# Altium schematic sheet ADC088S022_VAR.SchDoc
size A4; SheetNumber: 15; SheetTotal: 15
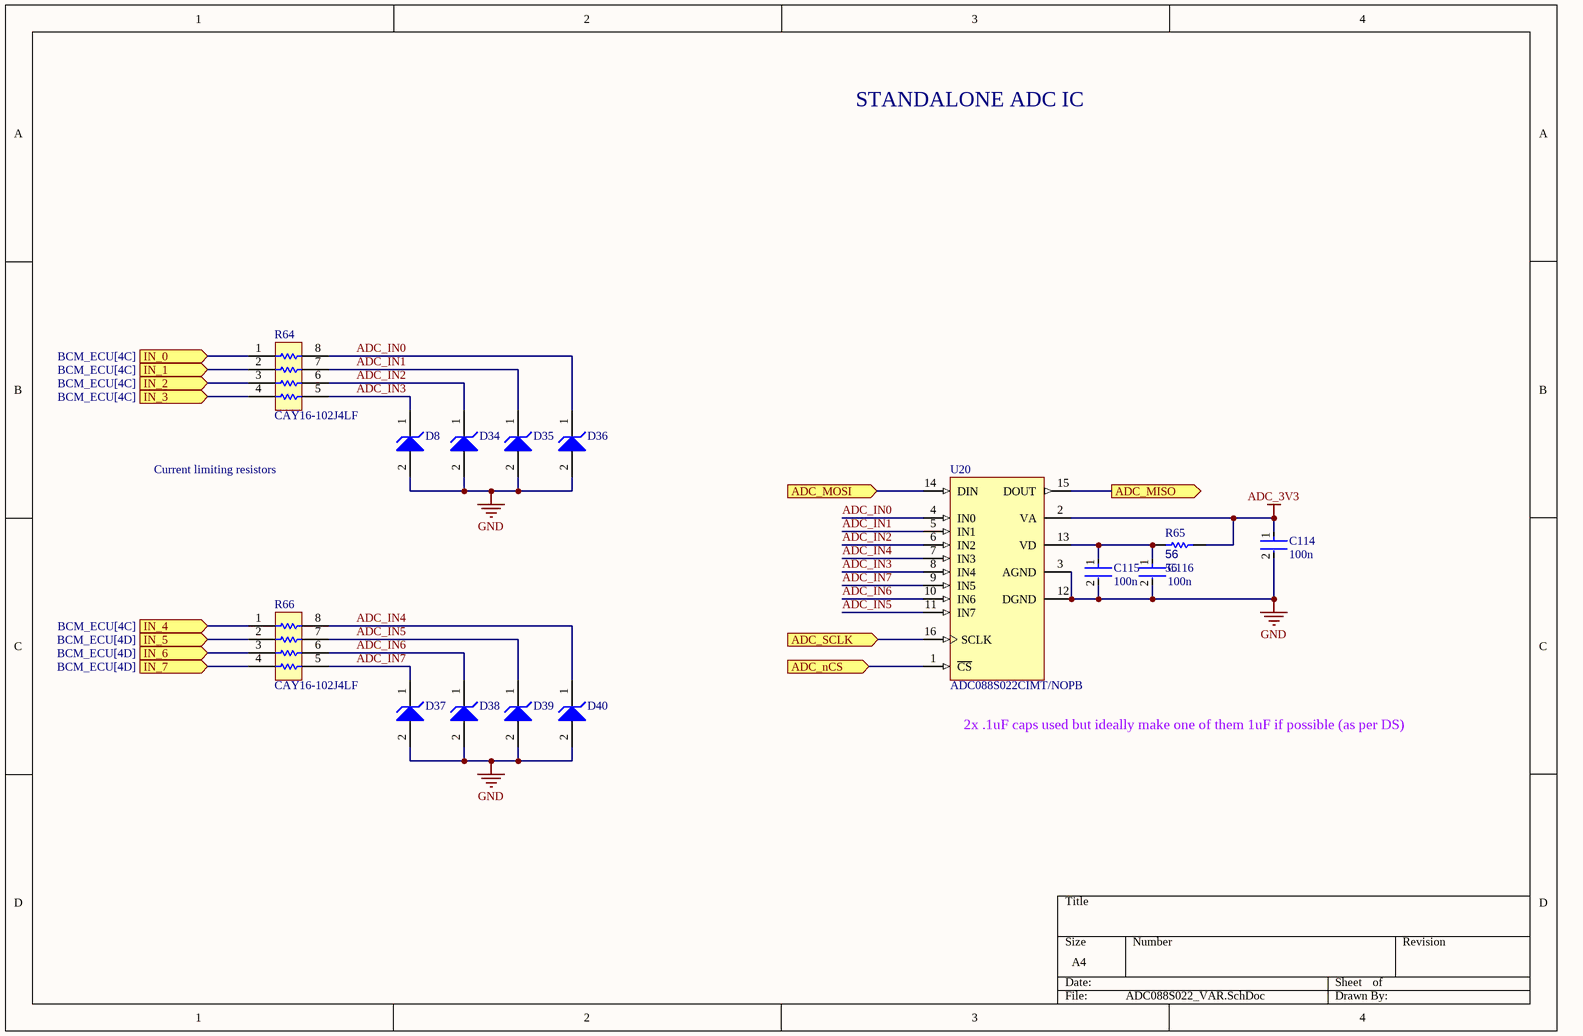
[diagram p0: ADC088S022_VAR.SchDoc]

## Parts
C114  100n  [FP-0402-L_1_0_0_05-W_0_5-IPC_A]
C115  100n  [FP-0402-L_1_0_0_05-W_0_5-IPC_A]
C116  100n  [FP-0402-L_1_0_0_05-W_0_5-IPC_A]
D8  MM5Z3V3T1G  [ONSC-SOD-523-2-502-01_V]  (value not drawn)
D34  MM5Z3V3T1G  [ONSC-SOD-523-2-502-01_V]  (value not drawn)
D35  MM5Z3V3T1G  [ONSC-SOD-523-2-502-01_V]  (value not drawn)
D36  MM5Z3V3T1G  [ONSC-SOD-523-2-502-01_V]  (value not drawn)
D37  MM5Z3V3T1G  [ONSC-SOD-523-2-502-01_V]  (value not drawn)
D38  MM5Z3V3T1G  [ONSC-SOD-523-2-502-01_V]  (value not drawn)
D39  MM5Z3V3T1G  [ONSC-SOD-523-2-502-01_V]  (value not drawn)
D40  MM5Z3V3T1G  [ONSC-SOD-523-2-502-01_V]  (value not drawn)
R64  CAY16-102J4LF  [BOUR-CAY16-J4_V]
R65  56  [R0603B]
R66  CAY16-102J4LF  [BOUR-CAY16-J4_V]
U20  ADC088S022CIMT/NOPB  [MTC16_L]

## Ports
ADC_MISO (out, see BCM_ECU[4C], ADC088S022[3B], MOSFET_BANK[1C]), ADC_MOSI (in, see BCM_ECU[4C], ADC088S022[3B], MOSFET_BANK[1C]), ADC_nCS (in, see BCM_ECU[4C]), ADC_SCLK (in, see BCM_ECU[4C], ADC088S022[3C], MOSFET_BANK[1D]), IN_0 (in, see BCM_ECU[4C]), IN_1 (in, see BCM_ECU[4C]), IN_2 (in, see BCM_ECU[4C]), IN_3 (in, see BCM_ECU[4C]), IN_4 (in, see BCM_ECU[4C]), IN_5 (in, see BCM_ECU[4D]), IN_6 (in, see BCM_ECU[4D]), IN_7 (in, see BCM_ECU[4D])

## Nets
ADC_3V3: C114.1 R65.1 U20.2(VA)
GND: C114.2 C115.2 C116.2 D8.2(A) D34.2(A) D35.2(A) D36.2(A) D37.2(A) D38.2(A) D39.2(A) D40.2(A) U20.3(AGND) U20.12(DGND)
ADC_IN0: D36.1(K) R64.8 U20.4(IN0)
ADC_IN1: D35.1(K) R64.7 U20.5(IN1)
ADC_IN2: D34.1(K) R64.6 U20.6(IN2)
ADC_IN3: D8.1(K) R64.5 U20.8(IN4)
ADC_IN4: D40.1(K) R66.8 U20.7(IN3)
ADC_IN5: D39.1(K) R66.7 U20.11(IN7)
ADC_IN6: D38.1(K) R66.6 U20.10(IN6)
ADC_IN7: D37.1(K) R66.5 U20.9(IN5)
ADC_MISO: U20.15(DOUT) ; port ADC_MISO
ADC_MOSI: U20.14(DIN) ; port ADC_MOSI
ADC_nCS: U20.1(~{CS}) ; port ADC_nCS
ADC_SCLK: U20.16(SCLK) ; port ADC_SCLK
IN_0: R64.1 ; port IN_0
IN_1: R64.2 ; port IN_1
IN_2: R64.3 ; port IN_2
IN_3: R64.4 ; port IN_3
IN_4: R66.1 ; port IN_4
IN_5: R66.2 ; port IN_5
IN_6: R66.3 ; port IN_6
IN_7: R66.4 ; port IN_7
NetC115_1: C115.1 C116.1 R65.2 U20.13(VD)

## Notes on the sheet
- STANDALONE ADC IC
- Current limiting resistors
- (near U20) 2x .1uF caps used but ideally make one of them 1uF if possible (as per DS)

## Library data of the parts
C114-C116 = CMP-001-00058-1: LARGE PADS, 0402 CAP, CHANGE COMMENT TO MATCH REAL P/N; Capacitor Type: Ceramic; Min Operating Temperature: -55°C; Mounting Technology: Surface Mount; Pins: 2; Case/Package: 0402; RoHS Compliant: Yes; Max Operating Temperature: 85°C
D8 D34-D40 = CMP-1060-00750-1: Zener Voltage Regulator, 500 mW, 2-Pin SOD-523, Pb-Free, Tape and Reel; Manufacturer: On Semiconductor; P Max (W): 0.5; VZ Typ (V): 3.3; RoHS: Pb-Free; ComponentLink2Description: Datasheet; PackageReference: SOD-523-2-502-01; DatasheetVersion: Rev. 10; ComponentLink1Description: Manufacturer URL; PackageVersion: Rev. E, 09/2010; ComponentLink3URL: http://www.onsemi.com/pub_link/Collateral/502-01.PDF; ComponentLink2URL: http://www.onsemi.cn/pub_link/Collateral/MM5Z2V4T1-D.PDF; Mounting Technology: Surface Mount; PartNumber: MM5Z3V3T1G; Packing: Tape and Reel; PackageDescription: 2-Pin SOD, Body 1.2 x 0.8 mm; ComponentLink1URL: http://www.onsemi.com/; ComponentLink3Description: Package Specification
R64 R66 = CMP-1747-00007-1: Chip Resistor Array, 1 KOhm, +/- 5%, 62.5 mW, -55 to 125 degC, 8-Pin SMD, RoHS, Tape and Reel; Power Rating: 100 mW; Tolerance: 1%; Voltage Rating (DC): 50 V; Resistance: 330 Ohm; Case\Package: 0603; RoHSCompliant: true; Case Code (Metric): 1608; Pins: 2; PackageDescription: 8-Pin Surface Mount Device, Body 1.6 x 3.2 mm, Pitch 0.8 mm; Height: 0.45 mm; Min Operating Temperature: -55 degC; ComponentLink1URL: http://www.bourns.com/; Case Code (Imperial): 0603; Packaging: Tape and Reel; PackageReference: CAY16-J4; ComponentLink1Description: Manufacturer URL; ComponentLink2Description: Datasheet; Length: 1.6 mm; Width: 0.8 mm; Max Operating Temperature: 155 degC; Mount: Surface Mount; DatasheetVersion: Sep-14; Voltage Rating: 50 V; REACH SVHC: No SVHC; ComponentLink2URL: http://www.bourns.com/pdfs/CATCAY.pdf; Package Quantity: 5000
R65 = CMP-009-00002-14: Resistor; Value: 56
U20 = CMP-0054-00372-2: 8-Channel, 50 kSPS to 200 kSPS, 8-Bit A/D Converter, 16-pin TSSOP, Pb-Free; Manufacturer: National Semiconductor; PackageTopMarking: NSUZXYTT*88S022*CIMT; CompType: ADC IC; PowerWise: Y; ComponentLink2URL: http://www.national.com/pf/AD/ADC088S022.html; RoHS: Y; PackageDescription: Molded TSSOP, Jedec, 5 x 4.4 x 0.9mm Body, 16 Lead, 0.65mm Pitch; DatasheetVersion: Feb-2010; PinCount: 16; ComponentLink1Description: ADC088S022 Datasheet; Code_JEDEC: MO-153-AB; ComponentLink3URL: http://www.national.com/packaging/folders/mtc16.html; PackageVersion: revD, Jun-2003; ComponentLink3Description: MTC16 Package Page; RevisionNote: Component URLs added; ComponentLink1URL: http://www.national.com/ds/AD/ADC088S022.pdf; ComponentLink2Description: ADC088S022 Web Page; PackageReference: MTC16